# Altium schematic sheet Biz-Card-SCH_SH2_(A).SchDoc: SCHEMATIC
size 863 x 558 mm; SheetNumber: 2; SheetTotal: 2; PageSetup: Record=PageOptions|CenterHorizontal=True|CenterVertical=True|PrintScale=0.98|XCorrection=1.00|YCorrection=1.00|PrintKind=2|BorderSize=5000000|LeftOffset=0|BottomOffset=0|Orientation=2|PaperLength=1000|PaperWidth=1000|Scale=100|PaperSource=15|PrintQuality=1200|MediaType=1|DitherType=10|PaperKind=11 x 17|PrintScaleMode=1
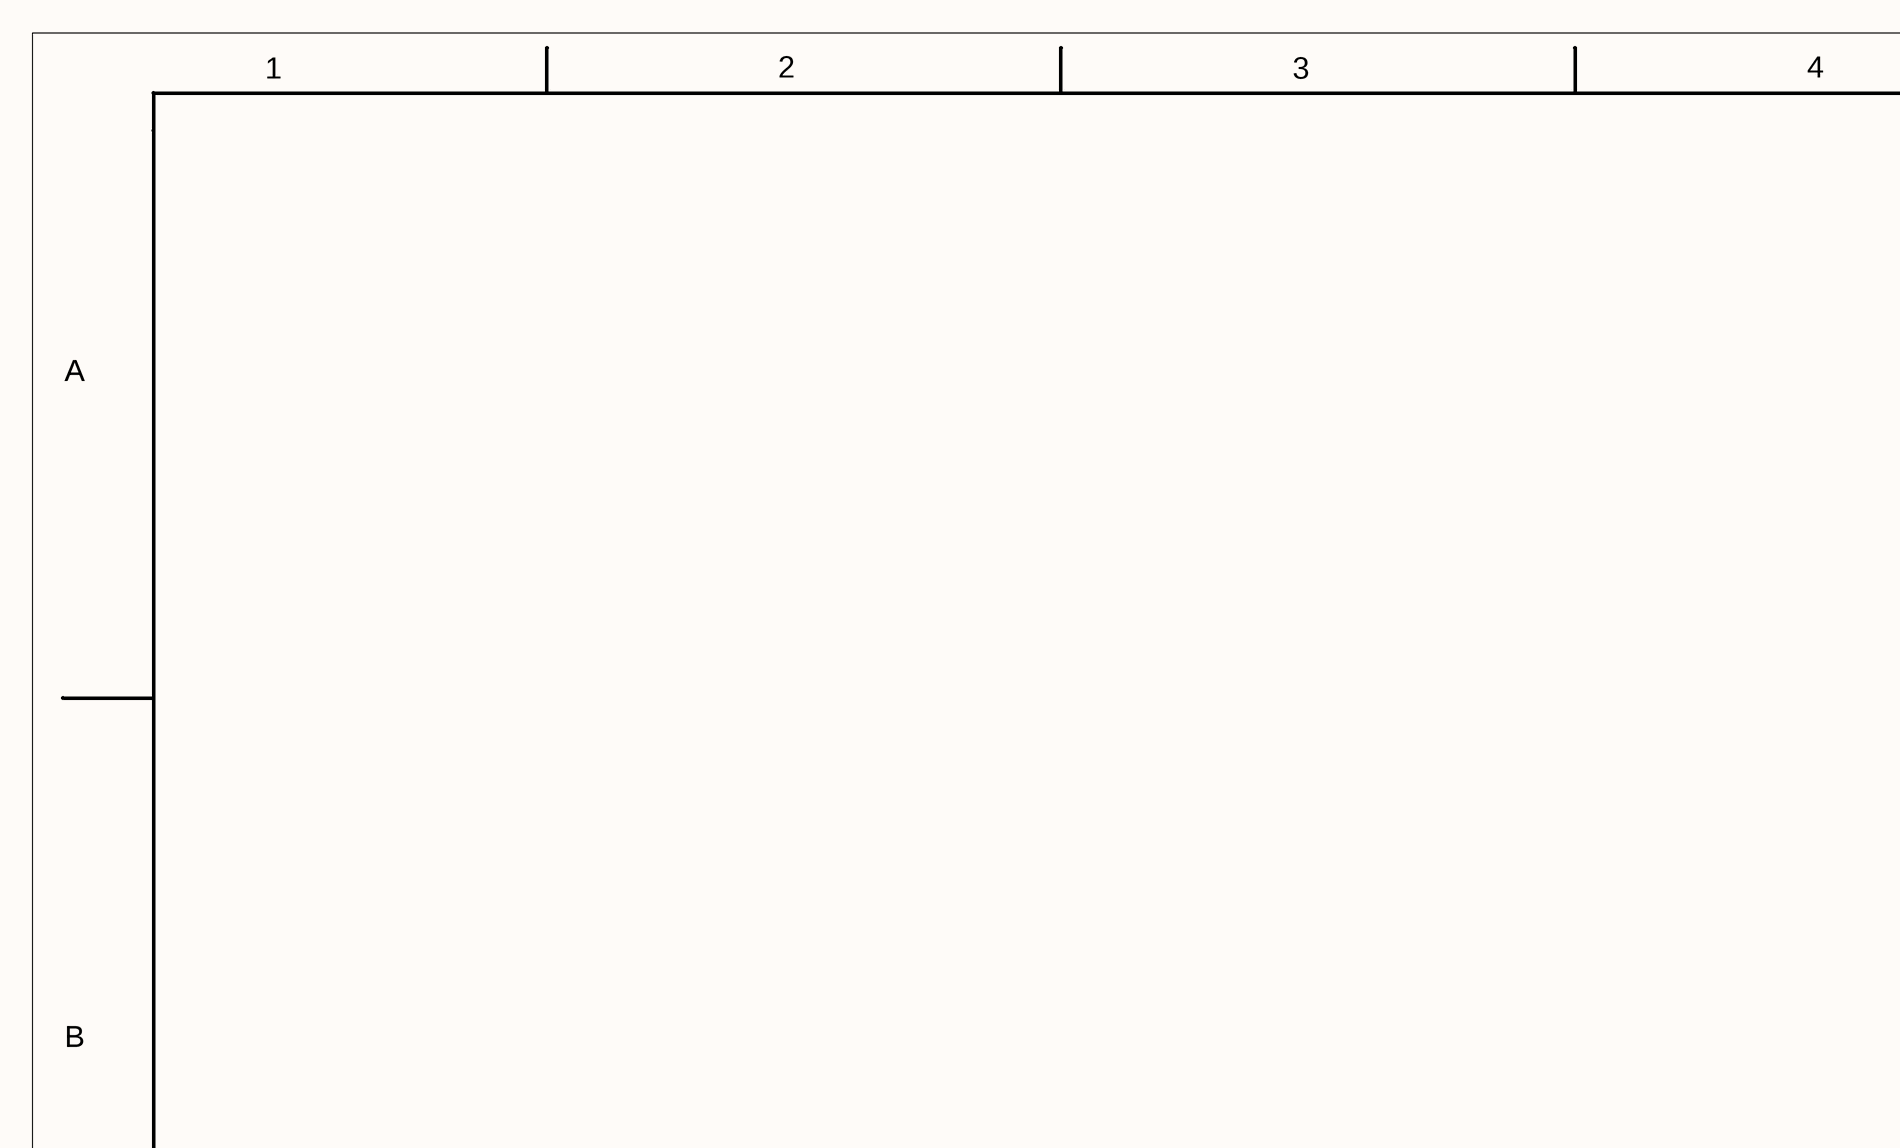
[diagram p0: Biz-Card-SCH_SH2_(A).SchDoc, top left]
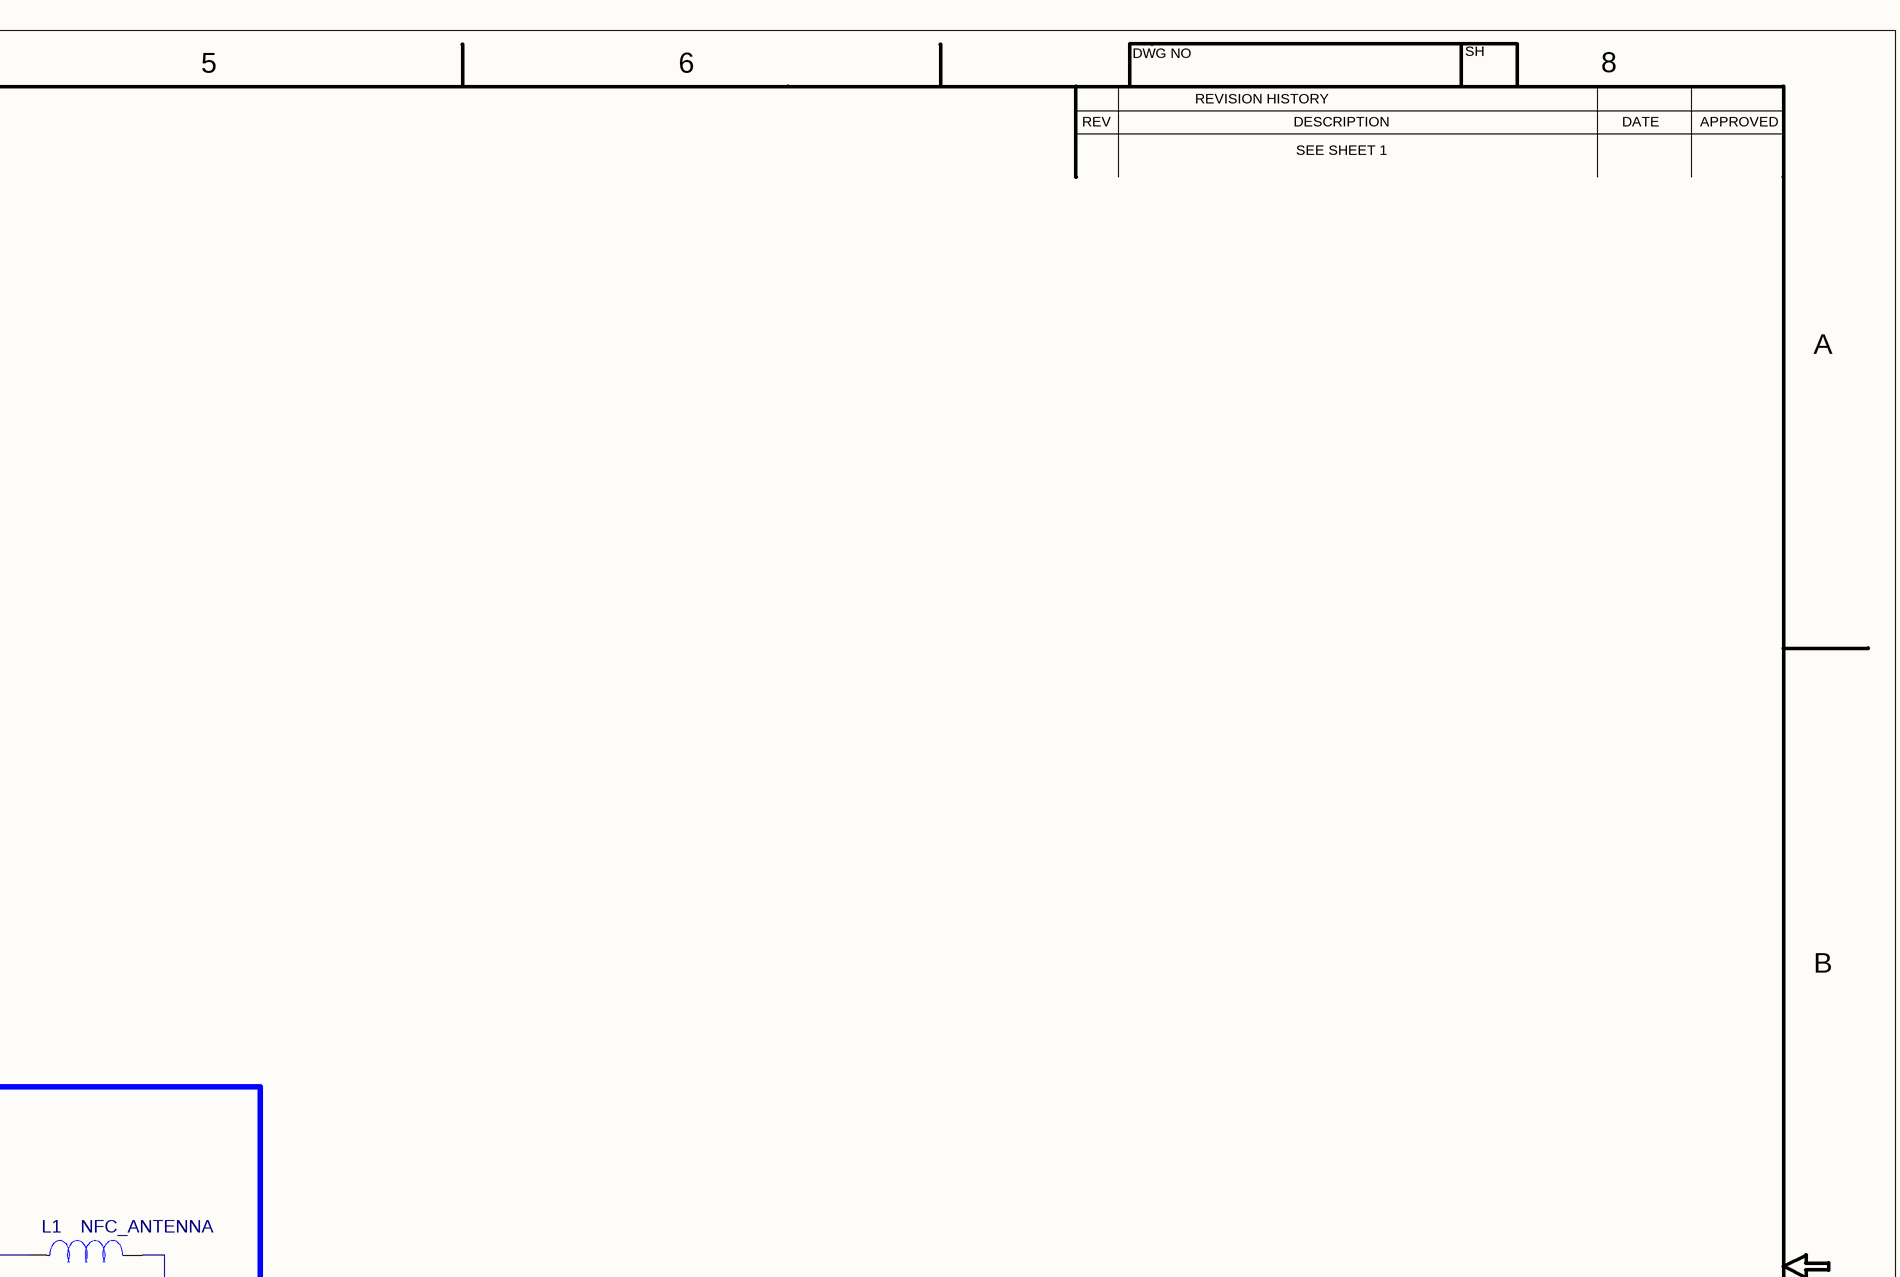
[diagram p1: Biz-Card-SCH_SH2_(A).SchDoc, top right]
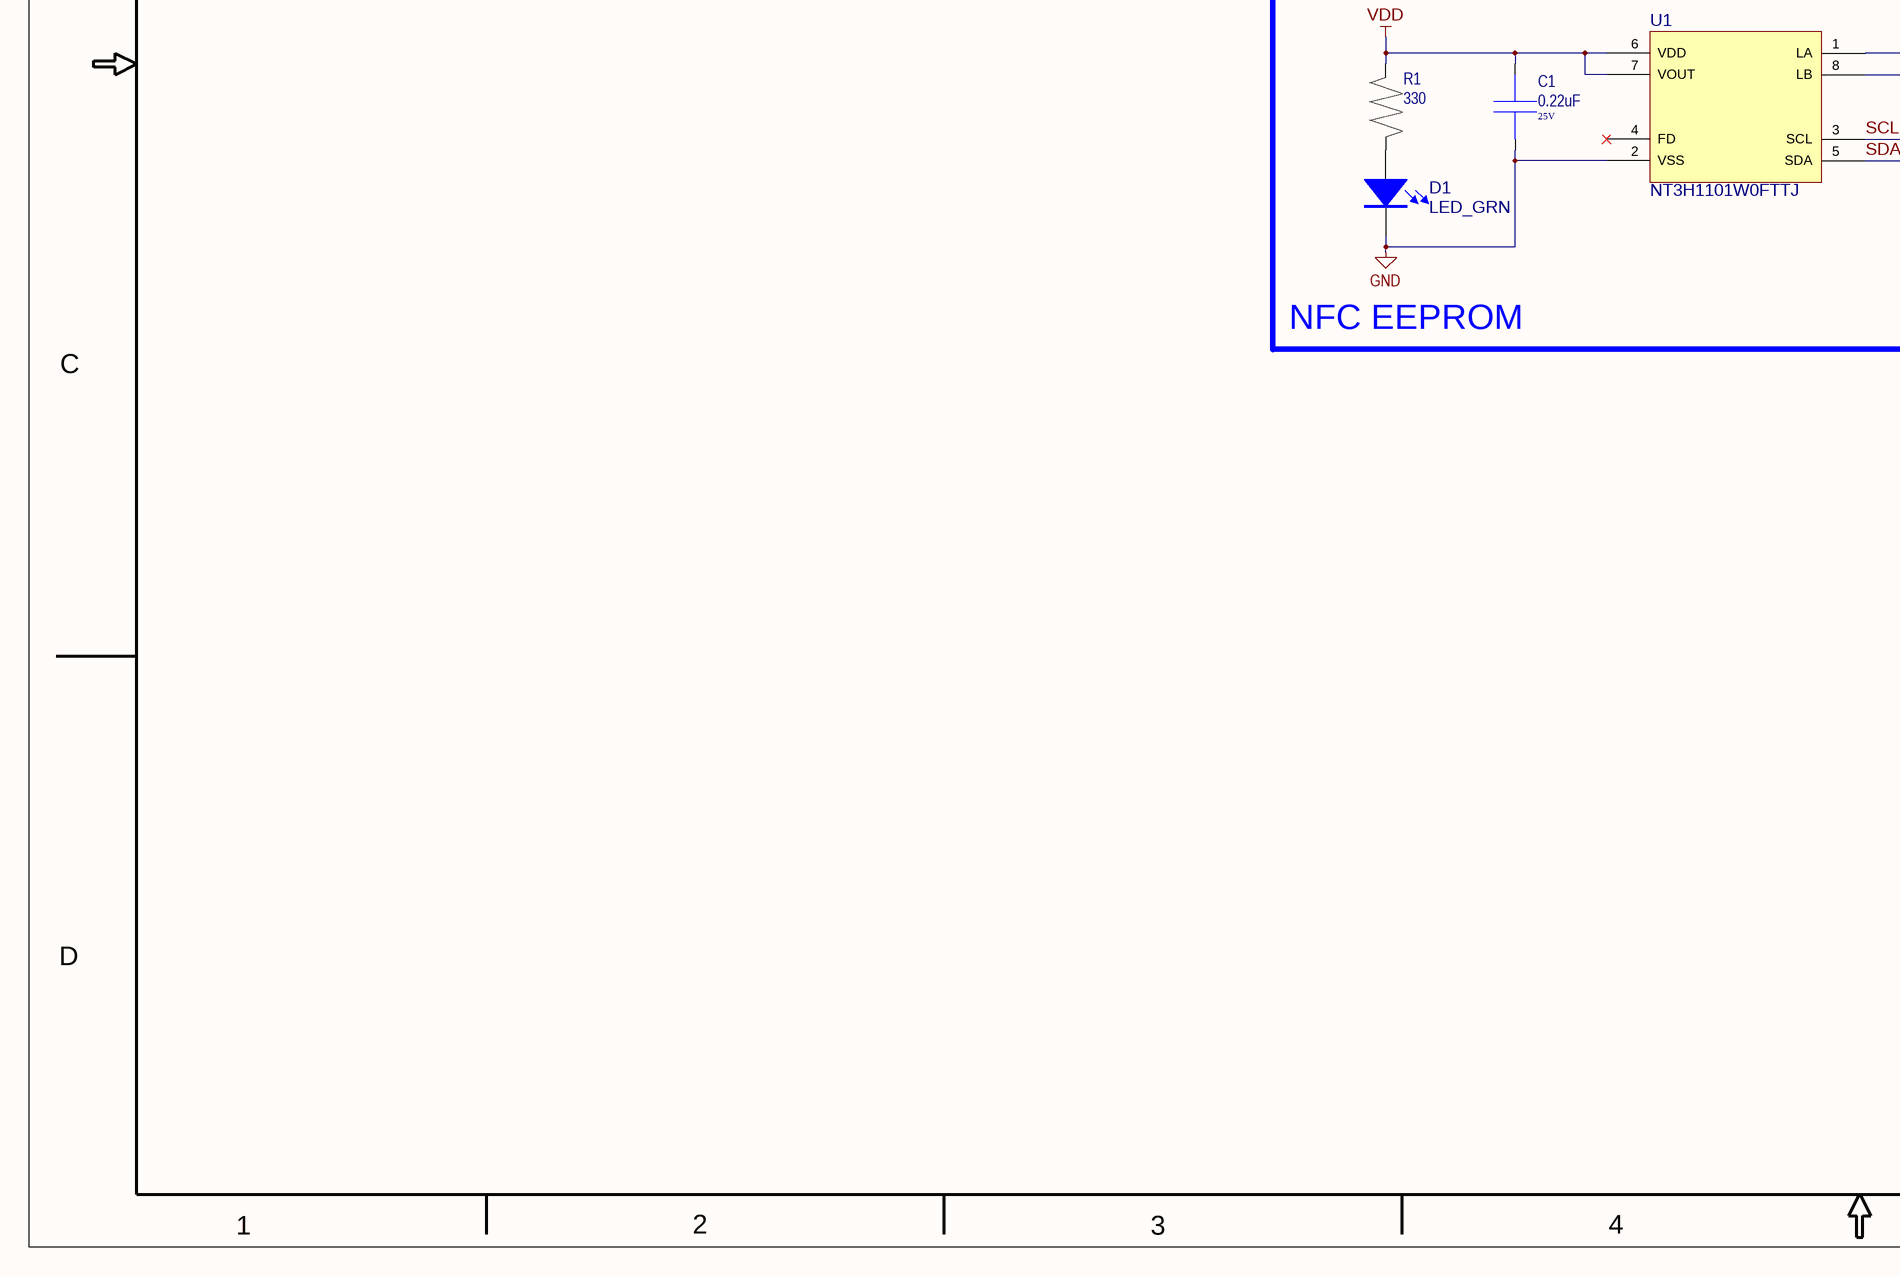
[diagram p2: Biz-Card-SCH_SH2_(A).SchDoc, bottom left]
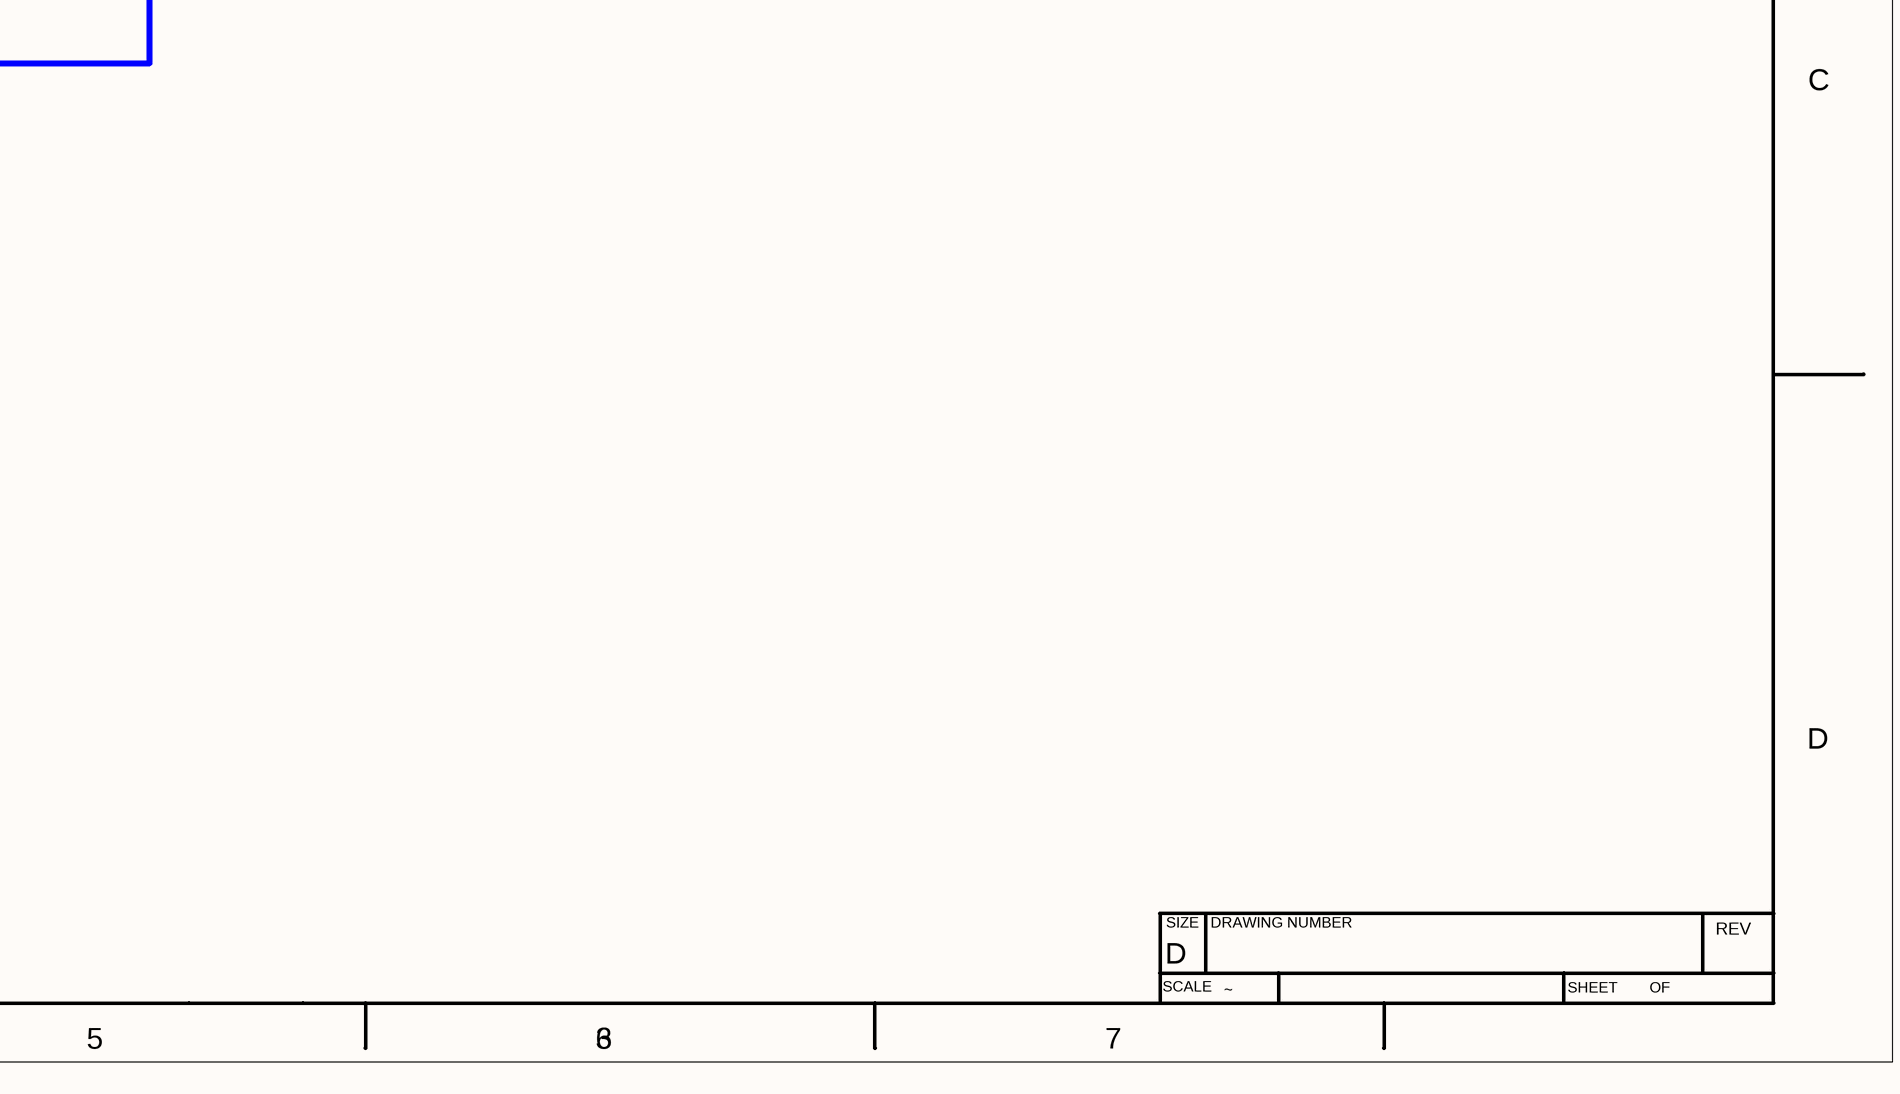
[diagram p3: Biz-Card-SCH_SH2_(A).SchDoc, bottom right]

## Parts
C1  0.22uF  Voltage: 25V  [0603]
D1  LED_GRN  [1206_LED]
L1  NFC_ANTENNA  [PLANAR_L_50x27mm]  (net tie, no BOM)
R1  330  [0603]
U1  NT3H1101W0FTTJ  [TSSOP-8]

## Blocks framed on the sheet
NFC EEPROM: C1 D1 L1 R1 U1

## Nets
GND: C1.1 D1.2(K) U1.2(VSS)
VDD: C1.2 R1.2 U1.6(VDD) U1.7(VOUT)
SCL: U1.3(SCL)
SDA: U1.5(SDA)
NetD1_1: D1.1(A) R1.1
NetL1_1: L1.1 U1.8(LB)
NetL1_2: L1.2 U1.1(LA)

Not connected (* = marked no-connect by the designer): U1 4(FD)*

## Notes on the sheet
- 1
- 2
- 3
- 4
- 5
- 6
- DWG NO
- REVISION HISTORY
- SH
- 8
- REV
- DESCRIPTION
- SEE SHEET 1
- DATE
- APPROVED
- A
- B
- C
- D
- SIZE
- DRAWING NUMBER
- SCALE
- ~
- SHEET        OF
- 7

## Library data of the parts
C1 = CAP: CAP CER 0.22UF 25V X7R 0603; Part Number: CL10B224KA8NNNC; Manufacturer: Samsung Electro-Mechanics; ClassName: -
D1 = LED: LED GREEN CLEAR 1206 SMD; Part Number: LTST-C150GKT; Manufacturer: Lite-On Inc.
L1 = NFC_ANTENNA: PLANAR INDUCTOR 27X50 MM; Part Number: -; Manufacturer: -
R1 = RES: RES SMD 330 OHM 1% 1/10W 0603; Part Number: CR0603-FX-3300ELF; Manufacturer: Bourns Inc.; ClassName: -
U1 = NT3H1101: IC RFID TRANSP 13.56MHZ 8TSSOP; Manufacturer: NXP USA Inc.; Part Number: NT3H1101W0FTTJ